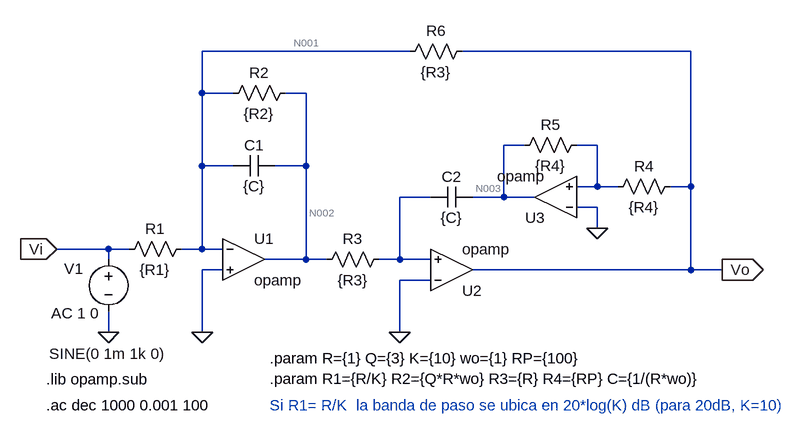
[diagram p0: schematic filtro_pasabajos.asc]
filtro_pasabajos.asc, the LTspice schematic file:
Version 4
SHEET 1 1180 680
WIRE 320 -80 0 -80
WIRE 752 -80 400 -80
WIRE 0 -16 0 -80
WIRE 48 -16 0 -16
WIRE 160 -16 128 -16
WIRE 496 64 464 64
WIRE 608 64 576 64
WIRE 0 96 0 -16
WIRE 48 96 0 96
WIRE 160 96 160 -16
WIRE 160 96 112 96
WIRE 608 128 608 64
WIRE 608 128 576 128
WIRE 640 128 608 128
WIRE 752 128 752 -80
WIRE 752 128 720 128
WIRE 352 144 304 144
WIRE 464 144 464 64
WIRE 464 144 416 144
WIRE 512 144 464 144
WIRE 608 160 576 160
WIRE 608 192 608 160
WIRE -144 224 -224 224
WIRE -112 224 -144 224
WIRE 0 224 0 96
WIRE 0 224 -32 224
WIRE 32 224 0 224
WIRE -144 240 -144 224
WIRE 160 240 160 96
WIRE 160 240 96 240
WIRE 192 240 160 240
WIRE 304 240 304 144
WIRE 304 240 272 240
WIRE 352 240 304 240
WIRE 32 256 0 256
WIRE 752 256 752 128
WIRE 752 256 416 256
WIRE 800 256 752 256
WIRE 352 272 304 272
WIRE -144 352 -144 320
WIRE 0 352 0 256
WIRE 304 352 304 272
FLAG 0 352 0
FLAG 304 352 0
FLAG 608 192 0
FLAG 800 256 Vo
IOPIN 800 256 Out
FLAG -144 352 0
FLAG -224 224 Vi
IOPIN -224 224 In
SYMBOL OpAmps\\opamp 64 176 R0
SYMATTR InstName U1
SYMBOL OpAmps\\opamp 384 320 M180
SYMATTR InstName U2
SYMBOL OpAmps\\opamp 544 208 R180
SYMATTR InstName U3
SYMBOL voltage -144 224 R0
WINDOW 0 -68 30 Left 2
WINDOW 3 -91 161 Left 2
WINDOW 123 -88 99 Left 2
WINDOW 39 0 0 Left 0
SYMATTR InstName V1
SYMATTR Value SINE(0 1m 1k 0)
SYMATTR Value2 AC 1 0
SYMBOL res -16 208 R90
WINDOW 0 0 56 VBottom 2
WINDOW 3 32 56 VTop 2
SYMATTR InstName R1
SYMATTR Value {R1}
SYMBOL res 144 -32 R90
WINDOW 0 0 56 VBottom 2
WINDOW 3 32 56 VTop 2
SYMATTR InstName R2
SYMATTR Value {R2}
SYMBOL res 288 224 R90
WINDOW 0 0 56 VBottom 2
WINDOW 3 32 56 VTop 2
SYMATTR InstName R3
SYMATTR Value {R3}
SYMBOL res 736 112 R90
WINDOW 0 0 56 VBottom 2
WINDOW 3 32 56 VTop 2
SYMATTR InstName R4
SYMATTR Value {R4}
SYMBOL res 592 48 R90
WINDOW 0 0 56 VBottom 2
WINDOW 3 32 56 VTop 2
SYMATTR InstName R5
SYMATTR Value {R4}
SYMBOL cap 112 80 R90
WINDOW 0 0 32 VBottom 2
WINDOW 3 32 32 VTop 2
SYMATTR InstName C1
SYMATTR Value {C}
SYMBOL cap 416 128 R90
WINDOW 0 0 32 VBottom 2
WINDOW 3 32 32 VTop 2
SYMATTR InstName C2
SYMATTR Value {C}
SYMBOL res 416 -96 R90
WINDOW 0 0 56 VBottom 2
WINDOW 3 32 56 VTop 2
SYMATTR InstName R6
SYMATTR Value {R3}
TEXT -240 424 Left 2 !.lib opamp.sub
TEXT 104 392 Left 2 !.param R={1} Q={3} K={10} wo={1} RP={100}\n.param R1={R/K} R2={Q*R*wo} R3={R} R4={RP} C={1/(R*wo)}
TEXT -240 464 Left 2 !.ac dec 1000 0.001 100
TEXT 104 464 Left 2 ;Si R1= R/K  la banda de paso se ubica en 20*log(K) dB (para 20dB, K=10)

The netlist it stands for:
* filtro_pasabajos.asc
XU1 N001 0 N002 opamp Aol=100K GBW=10Meg  ; pins invin noninvin out
XU2 0 N005 Vo opamp Aol=100K GBW=10Meg  ; pins invin noninvin out
XU3 0 N004 N003 opamp Aol=100K GBW=10Meg  ; pins invin noninvin out
V1 Vi 0 SINE(0 1m 1k 0) AC 1 0
R1 N001 Vi {R1}
R2 N002 N001 {R2}
R3 N005 N002 {R3}
R4 Vo N004 {R4}
R5 N004 N003 {R4}
C1 N002 N001 {C}
C2 N003 N005 {C}
R6 Vo N001 {R3}
.lib opamp.sub
.param R={1} Q={3} K={10} wo={1} RP={100}
.param R1={R/K} R2={Q*R*wo} R3={R} R4={RP} C={1/(R*wo)}
.ac dec 1000 0.001 100
* Si R1= R/K  la banda de paso se ubica en 20*log(K) dB (para 20dB, K=10)
.backanno
.end

* Results of the author's LTspice run, read from the files saved beside the schematic
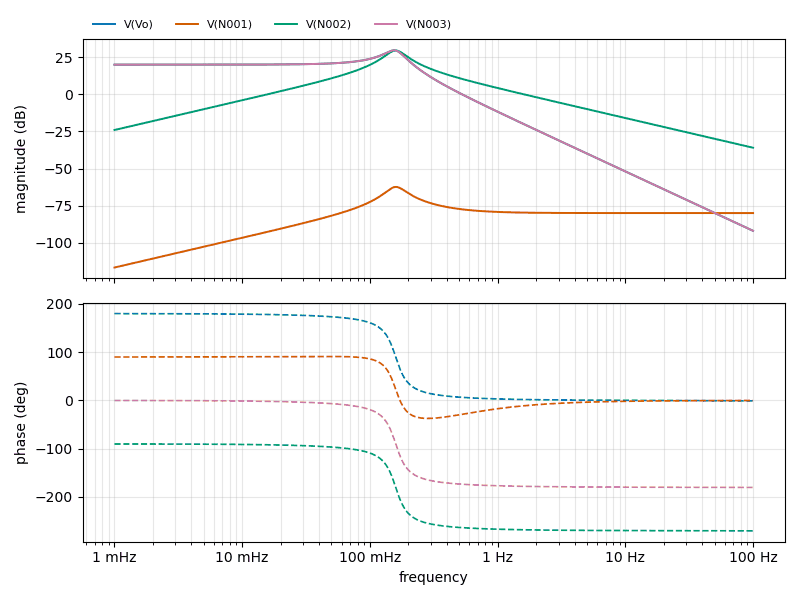
[diagram p1: AC Analysis of filtro_pasabajos.asc, plotted from the saved traces]
* AC Analysis, 1 run:
*   V(Vo): 20.00 dB at 1 mHz, -91.93 dB at 100 Hz, peak 29.66 dB at 154.5 mHz, 3 dB below the peak at 124.8 mHz and 179.6 mHz
*   V(N001): -116.68 dB at 1 mHz, -79.99 dB at 100 Hz, peak -62.37 dB at 160 mHz, 3 dB below the peak at 135.8 mHz and 189.8 mHz
*   V(N002): -24.04 dB at 1 mHz, -35.96 dB at 100 Hz, peak 29.54 dB at 159.2 mHz, 3 dB below the peak at 134.8 mHz and 187.9 mHz
*   V(N003): 20.00 dB at 1 mHz, -91.93 dB at 100 Hz, peak 29.66 dB at 154.5 mHz, 3 dB below the peak at 124.8 mHz and 179.6 mHz